# Altium schematic sheet RT1064_CoreBoard.SchDoc
size A4; SheetNumber: 1; SheetTotal: 4
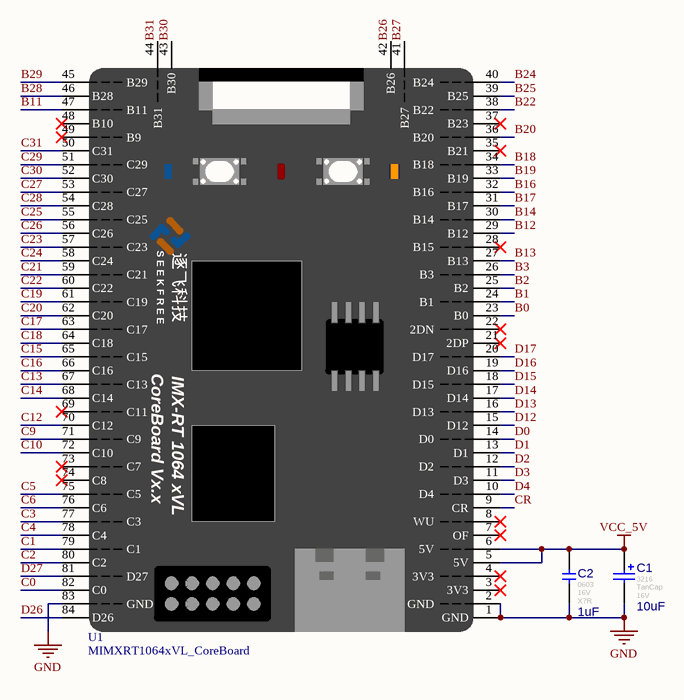
[diagram p0: RT1064_CoreBoard.SchDoc]

## Parts
C1  value 10uF  FootPrint: 3216  Type: TanCap  Voltage: 16V  [CAP-T-S 3216]  (hidden comment: T-S 10uF 3216 16V)
C2  value 1uF  FootPrint: 0603  Voltage: 16V  Type: X7R  [CAPC1608[0603]S-L]  (hidden comment: 1uF 16V X7R)
U1  MIMXRT1064xVL_CoreBoard  [MIMXRT1064xVL_CoreBoard - 3D]

## Nets
GND: C1.2 C2.1 U1.1(GND) U1.2(GND) U1.83(GND)
VCC_5V: C1.1 C2.2 U1.5(5V) U1.6(5V)
B0: U1.23(B0)
B1: U1.24(B1)
B2: U1.25(B2)
B3: U1.26(B3)
B11: U1.47(B11)
B12: U1.29(B12)
B13: U1.27(B13)
B14: U1.30(B14)
B16: U1.32(B16)
B17: U1.31(B17)
B18: U1.34(B18)
B19: U1.33(B19)
B20: U1.36(B20)
B22: U1.38(B22)
B24: U1.40(B24)
B25: U1.39(B25)
B26: U1.42(B26)
B27: U1.41(B27)
B28: U1.46(B28)
B29: U1.45(B29)
B30: U1.43(B30)
B31: U1.44(B31)
C0: U1.82(C0)
C1: U1.79(C1)
C2: U1.80(C2)
C3: U1.77(C3)
C4: U1.78(C4)
C5: U1.75(C5)
C6: U1.76(C6)
C9: U1.71(C9)
C10: U1.72(C10)
C12: U1.70(C12)
C13: U1.67(C13)
C14: U1.68(C14)
C15: U1.65(C15)
C16: U1.66(C16)
C17: U1.63(C17)
C18: U1.64(C18)
C19: U1.61(C19)
C20: U1.62(C20)
C21: U1.59(C21)
C22: U1.60(C22)
C23: U1.57(C23)
C24: U1.58(C24)
C25: U1.55(C25)
C26: U1.56(C26)
C27: U1.53(C27)
C28: U1.54(C28)
C29: U1.51(C29)
C30: U1.52(C30)
C31: U1.50(C31)
CR: U1.9(CR)
D0: U1.14(D0)
D1: U1.13(D1)
D2: U1.12(D2)
D3: U1.11(D3)
D4: U1.10(D4)
D12: U1.15(D12)
D13: U1.16(D13)
D14: U1.17(D14)
D15: U1.18(D15)
D16: U1.19(D16)
D17: U1.20(D17)
D26: U1.84(D26)
D27: U1.81(D27)

Not connected (* = marked no-connect by the designer): U1 3(3V3)* 4(3V3)* 7(OF)* 8(WU)* 21(2DP)* 22(2DN)* 28(B15)* 35(B21)* 37(B23)* 48(B10)* 49(B9)* 69(C11)* 73(C7)* 74(C8)*

## Notes on the sheet
- (in symbol MIMXRT1064xVL_CoreBoard) S E E K F R E E; 逐飞科技; CoreBoard Vx.x; IMX-RT 1064 xVL

## Library data of the parts
C1 = T-S 10uF 3216 16V: 贴片钽电容 10uF 3216 16V; Revision: July-2002: Re-released for DXP Platform.
C2 = 1uF 0603 16V X7R: 贴片瓷片电容; MLCC; 0603(1608);; Revision: V1.0
U1 = MIMXRT1064xVL_CoreBoard: 逐飞科技i.MX RT1064核心板整体原理，可直接使用